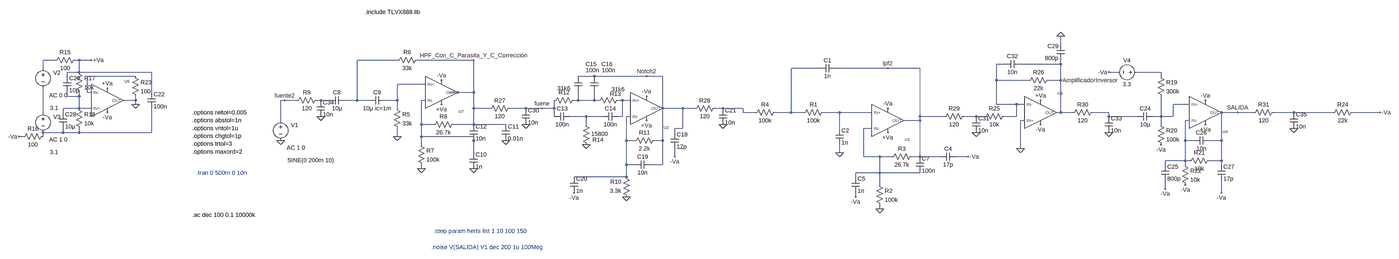
[diagram p0: schematic FILTRADO_COMPLETO.asc, whole sheet]
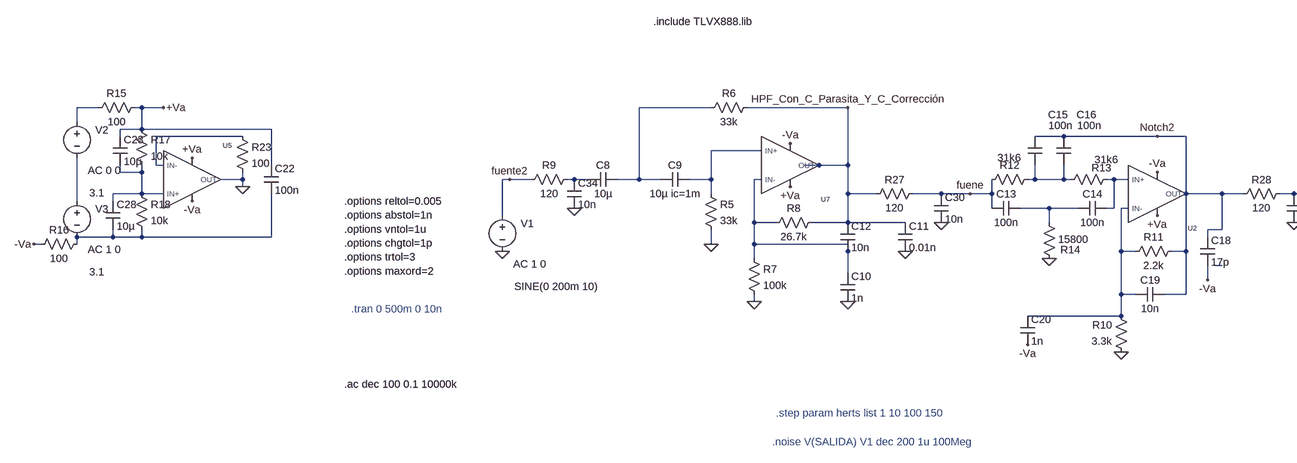
[diagram p1: schematic FILTRADO_COMPLETO.asc, part, row 1 of 1, column 1 of 2]
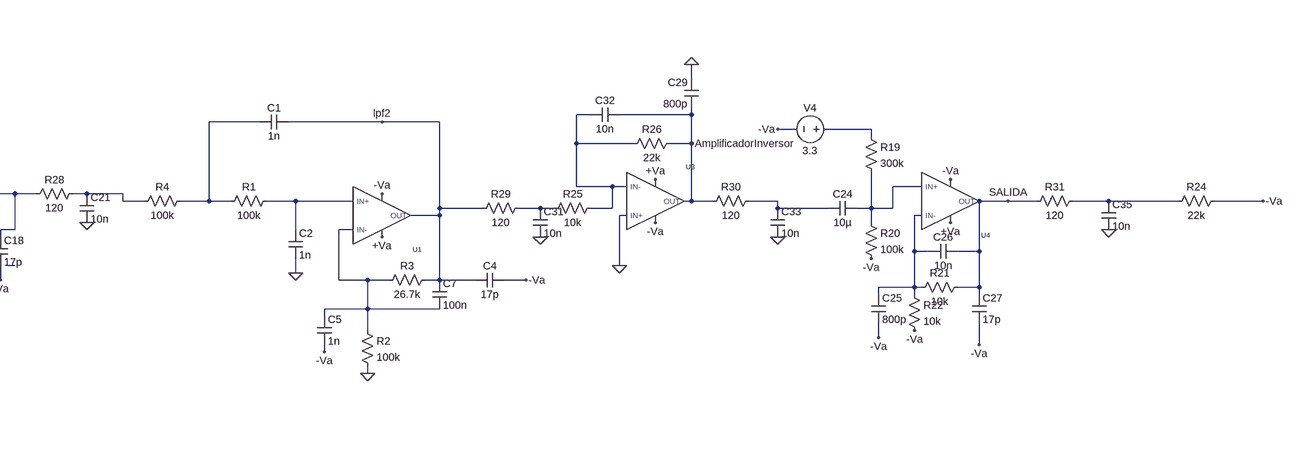
[diagram p2: schematic FILTRADO_COMPLETO.asc, part, row 1 of 1, column 2 of 2]
FILTRADO_COMPLETO.asc, the LTspice schematic file:
Version 4.1
SHEET 1 3832 900
WIRE 2320 -128 2320 -160
WIRE -1760 -64 -1808 -64
WIRE -1664 -64 -1680 -64
WIRE -1616 -64 -1664 -64
WIRE -320 -64 -480 -64
WIRE -16 -64 -240 -64
WIRE 2096 -48 2064 -48
WIRE 2320 -48 2320 -64
WIRE 2320 -48 2160 -48
WIRE -1808 -32 -1808 -64
WIRE 1360 -32 1248 -32
WIRE 1632 -32 1424 -32
WIRE 1760 -32 1632 -32
WIRE -1664 -16 -1664 -64
WIRE -1664 -16 -1712 -16
WIRE -1376 -16 -1664 -16
WIRE 2544 -16 2512 -16
WIRE 2720 -16 2624 -16
WIRE -1712 0 -1712 -16
WIRE -1440 0 -1632 0
WIRE 464 0 400 0
WIRE 672 0 464 0
WIRE 736 0 672 0
WIRE 2720 0 2720 -16
WIRE 2064 16 2064 -48
WIRE 2192 16 2064 16
WIRE 2320 16 2320 -48
WIRE 2320 16 2272 16
WIRE -208 32 -320 32
WIRE -1632 64 -1632 0
WIRE -1616 64 -1632 64
WIRE -1376 64 -1376 -16
WIRE -80 64 -112 64
WIRE -16 64 -16 -64
WIRE -16 64 -80 64
WIRE -1712 80 -1712 64
WIRE -1664 80 -1664 64
WIRE -1664 80 -1712 80
WIRE -1440 96 -1440 80
WIRE -1440 96 -1488 96
WIRE -768 96 -784 96
WIRE -720 96 -768 96
WIRE -624 96 -640 96
WIRE -592 96 -624 96
WIRE -480 96 -480 -64
WIRE -480 96 -528 96
WIRE -432 96 -480 96
WIRE -320 96 -320 32
WIRE -320 96 -368 96
WIRE -208 96 -224 96
WIRE 400 96 400 64
WIRE 400 96 384 96
WIRE 464 96 464 64
WIRE 464 96 400 96
WIRE 480 96 464 96
WIRE 576 96 560 96
WIRE 608 96 576 96
WIRE -1440 112 -1440 96
WIRE 2064 112 2064 16
WIRE 2144 112 2064 112
WIRE 2176 112 2144 112
WIRE 2832 112 2768 112
WIRE -1664 128 -1664 80
WIRE -1664 128 -1728 128
WIRE -1616 128 -1664 128
WIRE -320 128 -320 96
WIRE -16 128 -16 64
WIRE 48 128 -16 128
WIRE 192 128 128 128
WIRE 256 128 192 128
WIRE 304 128 304 96
WIRE 304 128 256 128
WIRE 736 128 736 0
WIRE 816 128 736 128
WIRE 864 128 816 128
WIRE 976 128 944 128
WIRE 1056 128 976 128
WIRE -1808 144 -1808 48
WIRE -1728 144 -1728 128
WIRE 1056 144 1056 128
WIRE 1104 144 1056 144
WIRE 1248 144 1248 -32
WIRE 1248 144 1184 144
WIRE 1296 144 1248 144
WIRE 1440 144 1376 144
WIRE 1568 144 1440 144
WIRE 2320 144 2320 16
WIRE 2320 144 2304 144
WIRE 2368 144 2320 144
WIRE 2512 144 2448 144
WIRE 3024 144 2960 144
WIRE 3088 144 3024 144
WIRE 3248 144 3168 144
WIRE 3488 144 3248 144
WIRE 3776 144 3568 144
WIRE 304 160 304 128
WIRE 432 160 368 160
WIRE 496 160 432 160
WIRE 576 160 576 96
WIRE 576 160 560 160
WIRE 608 160 592 160
WIRE 1760 160 1760 -32
WIRE 1856 160 1760 160
WIRE 1984 160 1936 160
WIRE 2016 160 1984 160
WIRE 2144 160 2144 112
WIRE 2144 160 2096 160
WIRE 2512 160 2512 144
WIRE 2624 160 2512 160
WIRE 2720 160 2720 80
WIRE 2720 160 2688 160
WIRE 2768 160 2768 112
WIRE 2768 160 2720 160
WIRE -784 176 -784 96
WIRE 1760 176 1760 160
WIRE 1760 176 1696 176
WIRE 2176 176 2160 176
WIRE 2832 176 2816 176
WIRE -224 192 -224 96
WIRE -176 192 -224 192
WIRE -16 192 -16 128
WIRE -16 192 -96 192
WIRE 112 192 -16 192
WIRE 432 192 432 160
WIRE 2720 192 2720 160
WIRE 816 208 816 128
WIRE 816 208 784 208
WIRE 1440 208 1440 144
WIRE 1568 208 1536 208
WIRE -1728 224 -1728 208
WIRE -1728 224 -1808 224
WIRE -1664 224 -1664 208
WIRE -1664 224 -1728 224
WIRE -1376 224 -1376 128
WIRE -1376 224 -1664 224
WIRE 784 224 784 208
WIRE -1888 240 -1904 240
WIRE -1808 240 -1808 224
WIRE -320 240 -320 208
WIRE -224 240 -224 192
WIRE -16 240 -224 240
WIRE -16 256 -16 240
WIRE 592 256 592 160
WIRE 624 256 592 256
WIRE 736 256 736 128
WIRE 736 256 704 256
WIRE 2816 256 2816 176
WIRE 2848 256 2816 256
WIRE 2960 256 2960 144
WIRE 2960 256 2912 256
WIRE -224 272 -224 240
WIRE 816 288 800 288
WIRE 2160 288 2160 176
WIRE -16 304 -16 256
WIRE 1440 304 1440 272
WIRE 784 320 784 288
WIRE 1536 320 1536 208
WIRE 1600 320 1536 320
WIRE 1648 320 1600 320
WIRE 1760 320 1760 176
WIRE 1760 320 1728 320
WIRE 1840 320 1760 320
WIRE 1952 320 1904 320
WIRE 2816 336 2816 256
WIRE 2816 336 2736 336
WIRE 2832 336 2816 336
WIRE 2960 336 2960 256
WIRE 2960 336 2912 336
WIRE 592 352 592 256
WIRE 624 352 592 352
WIRE 736 352 736 256
WIRE 736 352 688 352
WIRE 2736 352 2736 336
WIRE 2816 352 2816 336
WIRE 2960 352 2960 336
WIRE -224 368 -224 352
WIRE 1600 384 1600 320
WIRE 1600 384 1504 384
WIRE 1760 384 1600 384
WIRE 592 400 592 352
WIRE 592 400 384 400
WIRE 1504 400 1504 384
WIRE 1600 432 1600 384
WIRE 2736 448 2736 416
WIRE 2960 464 2960 416
WIRE 1504 480 1504 464
WIRE 1600 528 1600 512
FLAG 1632 224 +Va
FLAG 1632 128 -Va
FLAG 1440 304 0
FLAG 1600 528 0
FLAG 1632 -32 lpf2
FLAG 1952 320 -Va
FLAG 1504 480 -Va
FLAG -320 240 0
FLAG -144 112 +Va
FLAG -144 16 -Va
FLAG -16 -64 HPF_Con_C_Parasita_Y_C_Corrección
FLAG -224 368 0
FLAG -784 256 0
FLAG -768 96 fuente2
FLAG -16 368 0
FLAG 112 256 0
FLAG 592 480 0
FLAG 672 80 -Va
FLAG 672 176 +Va
FLAG 672 0 Notch2
FLAG 432 272 0
FLAG 256 128 fuene
FLAG 384 464 -Va
FLAG 784 320 -Va
FLAG -1440 112 0
FLAG -1904 240 -Va
FLAG -1616 -64 +Va
FLAG 2896 96 -Va
FLAG 2896 192 +Va
FLAG -1552 48 +Va
FLAG -1552 144 -Va
FLAG 2720 272 -Va
FLAG 2512 -16 -Va
FLAG 2736 448 -Va
FLAG 2816 432 -Va
FLAG 3024 144 SALIDA
FLAG 2960 464 -Va
FLAG 2240 96 +Va
FLAG 2240 192 -Va
FLAG 2320 16 AmplificadorInversor
FLAG 2160 288 0
FLAG 2320 -160 0
FLAG 3776 144 -Va
FLAG 192 192 0
FLAG 976 192 0
FLAG 1984 224 0
FLAG 2512 224 0
FLAG -624 160 0
FLAG 3248 208 0
SYMBOL res 1392 128 R90
WINDOW 0 0 56 VBottom 2
WINDOW 3 32 56 VTop 2
SYMATTR InstName R1
SYMATTR Value 100k
SYMBOL cap 1424 -48 R90
WINDOW 0 0 32 VBottom 2
WINDOW 3 32 32 VTop 2
SYMATTR InstName C1
SYMATTR Value 1n
SYMBOL cap 1424 208 R0
SYMATTR InstName C2
SYMATTR Value 1n
SYMBOL res 1584 416 R0
SYMATTR InstName R2
SYMATTR Value 100k
SYMBOL res 1744 304 R90
WINDOW 0 0 56 VBottom 2
WINDOW 3 32 56 VTop 2
SYMATTR InstName R3
SYMATTR Value 26.7k
SYMBOL cap 1904 304 R90
WINDOW 0 0 32 VBottom 2
WINDOW 3 32 32 VTop 2
SYMATTR InstName C4
SYMATTR Value 17p
SYMBOL res 1200 128 R90
WINDOW 0 0 56 VBottom 2
WINDOW 3 32 56 VTop 2
SYMATTR InstName R4
SYMATTR Value 100k
SYMBOL cap 1488 400 R0
SYMATTR InstName C5
SYMATTR Value 1n
SYMBOL cap 1744 320 R0
SYMATTR InstName C7
SYMATTR Value 100n
SYMBOL cap -528 80 R90
WINDOW 0 0 32 VBottom 2
WINDOW 3 32 32 VTop 2
SYMATTR InstName C8
SYMATTR Value 10µ
SYMBOL cap -368 80 R90
WINDOW 0 0 32 VBottom 2
WINDOW 3 32 32 VTop 2
SYMATTR InstName C9
SYMATTR Value 10µ ic=1m
SYMBOL res -336 112 R0
SYMATTR InstName R5
SYMATTR Value 33k
SYMBOL res -224 -80 R90
WINDOW 0 0 56 VBottom 2
WINDOW 3 32 56 VTop 2
SYMATTR InstName R6
SYMATTR Value 33k
SYMBOL res -240 256 R0
SYMATTR InstName R7
SYMATTR Value 100k
SYMBOL res -80 176 R90
WINDOW 0 0 56 VBottom 2
WINDOW 3 32 56 VTop 2
SYMATTR InstName R8
SYMATTR Value 26.7k
SYMBOL voltage -784 160 R0
WINDOW 0 41 34 Left 2
WINDOW 123 24 124 Left 2
WINDOW 39 0 0 Left 0
WINDOW 3 27 174 Left 2
SYMATTR InstName V1
SYMATTR Value2 AC 1 0
SYMATTR Value SINE(0 200m 10)
SYMBOL res -624 80 R90
WINDOW 0 0 56 VBottom 2
WINDOW 3 32 56 VTop 2
SYMATTR InstName R9
SYMATTR Value 120
SYMBOL cap -32 304 R0
SYMATTR InstName C10
SYMATTR Value 1n
SYMBOL cap 96 192 R0
SYMATTR InstName C11
SYMATTR Value 0.01n
SYMBOL cap -32 192 R0
SYMATTR InstName C12
SYMATTR Value 10n
SYMBOL res 608 496 R180
WINDOW 0 36 76 Left 2
WINDOW 3 36 40 Left 2
SYMATTR InstName R10
SYMATTR Value 3.3k
SYMBOL res 720 240 R90
WINDOW 0 0 56 VBottom 2
WINDOW 3 32 56 VTop 2
SYMATTR InstName R11
SYMATTR Value 2.2k
SYMBOL res 400 80 R90
WINDOW 0 0 56 VBottom 2
WINDOW 3 -48 57 VTop 2
SYMATTR InstName R12
SYMATTR Value 31k6
SYMBOL res 576 80 R90
WINDOW 0 6 28 VBottom 2
WINDOW 3 -44 17 VTop 2
SYMATTR InstName R13
SYMATTR Value 31k6
SYMBOL cap 368 144 R90
WINDOW 0 0 32 VBottom 2
WINDOW 3 32 32 VTop 2
SYMATTR InstName C13
SYMATTR Value 100n
SYMBOL cap 560 144 R90
WINDOW 0 0 32 VBottom 2
WINDOW 3 32 32 VTop 2
SYMATTR InstName C14
SYMATTR Value 100n
SYMBOL cap 384 0 R0
WINDOW 3 46 -24 Left 2
WINDOW 0 45 -48 Left 2
SYMATTR Value 100n
SYMATTR InstName C15
SYMBOL res 416 176 R0
WINDOW 0 41 77 Left 2
WINDOW 3 36 53 Left 2
SYMATTR InstName R14
SYMATTR Value 15800
SYMBOL cap 448 0 R0
WINDOW 3 46 -24 Left 2
WINDOW 0 45 -48 Left 2
SYMATTR Value 100n
SYMATTR InstName C16
SYMBOL cap 768 224 R0
SYMATTR InstName C18
SYMATTR Value 17p
SYMBOL cap 688 336 R90
WINDOW 0 0 32 VBottom 2
WINDOW 3 32 32 VTop 2
SYMATTR InstName C19
SYMATTR Value 10n
SYMBOL cap 368 400 R0
SYMATTR InstName C20
SYMATTR Value 1n
SYMBOL cap 960 128 R0
SYMATTR InstName C21
SYMATTR Value 10n
SYMBOL voltage -1808 -48 R0
WINDOW 0 41 34 Left 2
WINDOW 123 24 124 Left 2
WINDOW 39 0 0 Left 0
WINDOW 3 27 174 Left 2
SYMATTR InstName V2
SYMATTR Value2 AC 0 0
SYMATTR Value 3.1
SYMBOL voltage -1808 128 R0
WINDOW 0 41 34 Left 2
WINDOW 123 24 124 Left 2
WINDOW 39 0 0 Left 0
WINDOW 3 27 174 Left 2
SYMATTR InstName V3
SYMATTR Value2 AC 1 0
SYMATTR Value 3.1
SYMBOL res -1664 -80 R90
WINDOW 0 0 56 VBottom 2
WINDOW 3 32 56 VTop 2
SYMATTR InstName R15
SYMATTR Value 100
SYMBOL res -1792 224 R90
WINDOW 0 0 56 VBottom 2
WINDOW 3 32 56 VTop 2
SYMATTR InstName R16
SYMATTR Value 100
SYMBOL res -1680 -32 R0
SYMATTR InstName R17
SYMATTR Value 10k
SYMBOL res -1680 112 R0
SYMATTR InstName R18
SYMATTR Value 10k
SYMBOL voltage 2640 -16 R90
WINDOW 0 -32 56 VBottom 2
WINDOW 3 32 56 VTop 2
WINDOW 123 0 0 Left 0
WINDOW 39 0 0 Left 0
SYMATTR InstName V4
SYMATTR Value 3.3
SYMBOL res 2704 -16 R0
SYMATTR InstName R19
SYMATTR Value 300k
SYMBOL res 2704 176 R0
SYMATTR InstName R20
SYMATTR Value 100k
SYMBOL cap 2688 144 R90
WINDOW 0 0 32 VBottom 2
WINDOW 3 32 32 VTop 2
SYMATTR InstName C24
SYMATTR Value 10µ
SYMBOL res 2928 320 R90
WINDOW 0 0 56 VBottom 2
WINDOW 3 32 56 VTop 2
SYMATTR InstName R21
SYMATTR Value 10k
SYMBOL res 2800 336 R0
SYMATTR InstName R22
SYMATTR Value 10k
SYMBOL cap 2720 352 R0
SYMATTR InstName C25
SYMATTR Value 800p
SYMBOL cap 2912 240 R90
WINDOW 0 0 32 VBottom 2
WINDOW 3 32 32 VTop 2
SYMATTR InstName C26
SYMATTR Value 10n
SYMBOL cap 2944 352 R0
SYMATTR InstName C27
SYMATTR Value 17p
SYMBOL res 3584 128 R90
WINDOW 0 0 56 VBottom 2
WINDOW 3 32 56 VTop 2
SYMATTR InstName R24
SYMATTR Value 22k
SYMBOL cap -1392 64 R0
SYMATTR InstName C22
SYMATTR Value 100n
SYMBOL cap -1728 0 R0
SYMATTR InstName C23
SYMATTR Value 10µ
SYMBOL cap -1744 144 R0
SYMATTR InstName C28
SYMATTR Value 10µ
SYMBOL res 2176 32 R270
WINDOW 0 32 56 VTop 2
WINDOW 3 0 56 VBottom 2
SYMATTR InstName R26
SYMATTR Value 22k
SYMBOL res 2112 144 R90
WINDOW 0 0 56 VBottom 2
WINDOW 3 32 56 VTop 2
SYMATTR InstName R25
SYMATTR Value 10k
SYMBOL TLVx888 -144 64 M180
SYMATTR InstName U7
SYMBOL TLVx888 672 128 M180
SYMATTR InstName U2
SYMBOL TLVx888 1632 176 M180
SYMATTR InstName U1
SYMBOL TLVx888 2240 144 R0
SYMATTR InstName U3
SYMBOL TLVx888 2896 144 M180
SYMATTR InstName U4
SYMBOL TLVx888 -1552 96 R0
SYMATTR InstName U5
SYMBOL cap 2336 -64 R180
WINDOW 0 24 56 Left 2
WINDOW 3 24 8 Left 2
SYMATTR InstName C29
SYMATTR Value 800p
SYMBOL cap 2096 -32 R270
WINDOW 0 32 32 VTop 2
WINDOW 3 0 32 VBottom 2
SYMATTR InstName C32
SYMATTR Value 10n
SYMBOL res -1456 -16 R0
SYMATTR InstName R23
SYMATTR Value 100
SYMBOL res 144 112 R90
WINDOW 0 0 56 VBottom 2
WINDOW 3 32 56 VTop 2
SYMATTR InstName R27
SYMATTR Value 120
SYMBOL cap 176 128 R0
SYMATTR InstName C30
SYMATTR Value 10n
SYMBOL res 960 112 R90
WINDOW 0 0 56 VBottom 2
WINDOW 3 32 56 VTop 2
SYMATTR InstName R28
SYMATTR Value 120
SYMBOL res 1952 144 R90
WINDOW 0 0 56 VBottom 2
WINDOW 3 32 56 VTop 2
SYMATTR InstName R29
SYMATTR Value 120
SYMBOL cap 1968 160 R0
SYMATTR InstName C31
SYMATTR Value 10n
SYMBOL res 2464 128 R90
WINDOW 0 0 56 VBottom 2
WINDOW 3 32 56 VTop 2
SYMATTR InstName R30
SYMATTR Value 120
SYMBOL cap 2496 160 R0
SYMATTR InstName C33
SYMATTR Value 10n
SYMBOL cap -640 96 R0
SYMATTR InstName C34
SYMATTR Value 10n
SYMBOL res 3184 128 R90
WINDOW 0 0 56 VBottom 2
WINDOW 3 32 56 VTop 2
SYMATTR InstName R31
SYMATTR Value 120
SYMBOL cap 3232 144 R0
SYMATTR InstName C35
SYMATTR Value 10n
TEXT -1120 384 Left 2 ;.tran 0 500m 0 10n
TEXT -1136 144 Left 2 !.options reltol=0.005\n.options abstol=1n\n.options vntol=1u\n.options chgtol=1p\n.options trtol=3\n.options maxord=2
TEXT -1136 552 Left 2 !.ac dec 100 0.1 10000k
TEXT -448 -256 Left 2 !.include TLVX888.lib
TEXT -184 680 Left 2 ;.noise V(SALIDA) V1 dec 200 1u 100Meg
TEXT -176 616 Left 2 ;.step param herts list 1 10 100 150

The netlist it stands for:
* FILTRADO_COMPLETO.asc
R1 N016 N004 100k
C1 lpf2 N004 1n
C2 N016 0 1n
R2 N023 0 100k
R3 lpf2 N023 26.7k
C4 -Va lpf2 17p
R4 N004 N014 100k
C5 N023 -Va 1n
C7 lpf2 N023 100n
C8 N002 N009 10µ
C9 N007 N002 10µ ic=1m
R5 N007 0 33k
R6 HPF_Con_C_Parasita_Y_C_Corrección N002 33k
R7 N010 0 100k
R8 HPF_Con_C_Parasita_Y_C_Corrección N010 26.7k
V1 fuente2 0 SINE(0 200m 10) AC 1 0
R9 N009 fuente2 120
C10 N010 0 1n
C11 HPF_Con_C_Parasita_Y_C_Corrección 0 0.01n
C12 HPF_Con_C_Parasita_Y_C_Corrección N010 10n
R10 0 N020 3.3k
R11 Notch2 N020 2.2k
R12 N011 fuene 31k6
R13 N012 N011 31k6
C13 N019 fuene 100n
C14 N012 N019 100n
C15 Notch2 N011 100n
R14 N019 0 15800
C16 Notch2 N011 100n
C18 Notch2 -Va 17p
C19 Notch2 N020 10n
C20 N020 -Va 1n
C21 N014 0 10n
V2 N001 N015 3.1 AC 0 0
V3 N015 N024 3.1 AC 1 0
R15 +Va N001 100
R16 N024 -Va 100
R17 +Va N008 10k
R18 N008 N024 10k
V4 N005 -Va 3.3
R19 N005 N013 300k
R20 N013 -Va 100k
C24 N013 N017 10µ
R21 SALIDA N022 10k
R22 N022 -Va 10k
C25 N022 -Va 800p
C26 SALIDA N022 10n
C27 SALIDA -Va 17p
R24 -Va N018 22k
C22 +Va N024 100n
C23 +Va N008 10µ
C28 N008 N024 10µ
R26 N003 AmplificadorInversor 22k
R25 N003 N021 10k
X§U7 N007 N010 +Va -Va HPF_Con_C_Parasita_Y_C_Corrección TLVX888  ; pins IN+ IN- VCC VEE OUT
X§U2 N012 N020 +Va -Va Notch2 TLVX888  ; pins IN+ IN- VCC VEE OUT
X§U1 N016 N023 +Va -Va lpf2 TLVX888  ; pins IN+ IN- VCC VEE OUT
X§U3 0 N003 +Va -Va AmplificadorInversor TLVX888  ; pins IN+ IN- VCC VEE OUT
X§U4 N013 N022 +Va -Va SALIDA TLVX888  ; pins IN+ IN- VCC VEE OUT
X§U5 N008 N006 +Va -Va 0 TLVX888  ; pins IN+ IN- VCC VEE OUT
C29 AmplificadorInversor 0 800p
C32 N003 AmplificadorInversor 10n
R23 N006 0 100
R27 fuene HPF_Con_C_Parasita_Y_C_Corrección 120
C30 fuene 0 10n
R28 N014 Notch2 120
R29 N021 lpf2 120
C31 N021 0 10n
R30 N017 AmplificadorInversor 120
C33 N017 0 10n
C34 N009 0 10n
R31 N018 SALIDA 120
C35 N018 0 10n
* .tran 0 500m 0 10n
.options reltol=0.005
.options abstol=1n
.options vntol=1u
.options chgtol=1p
.options trtol=3
.options maxord=2
.ac dec 100 0.1 10000k
.include TLVX888.lib
* .noise V(SALIDA) V1 dec 200 1u 100Meg
* .step param herts list 1 10 100 150
.backanno
.end